# EAGLE design skydrop (EAGLE 7.5.0)
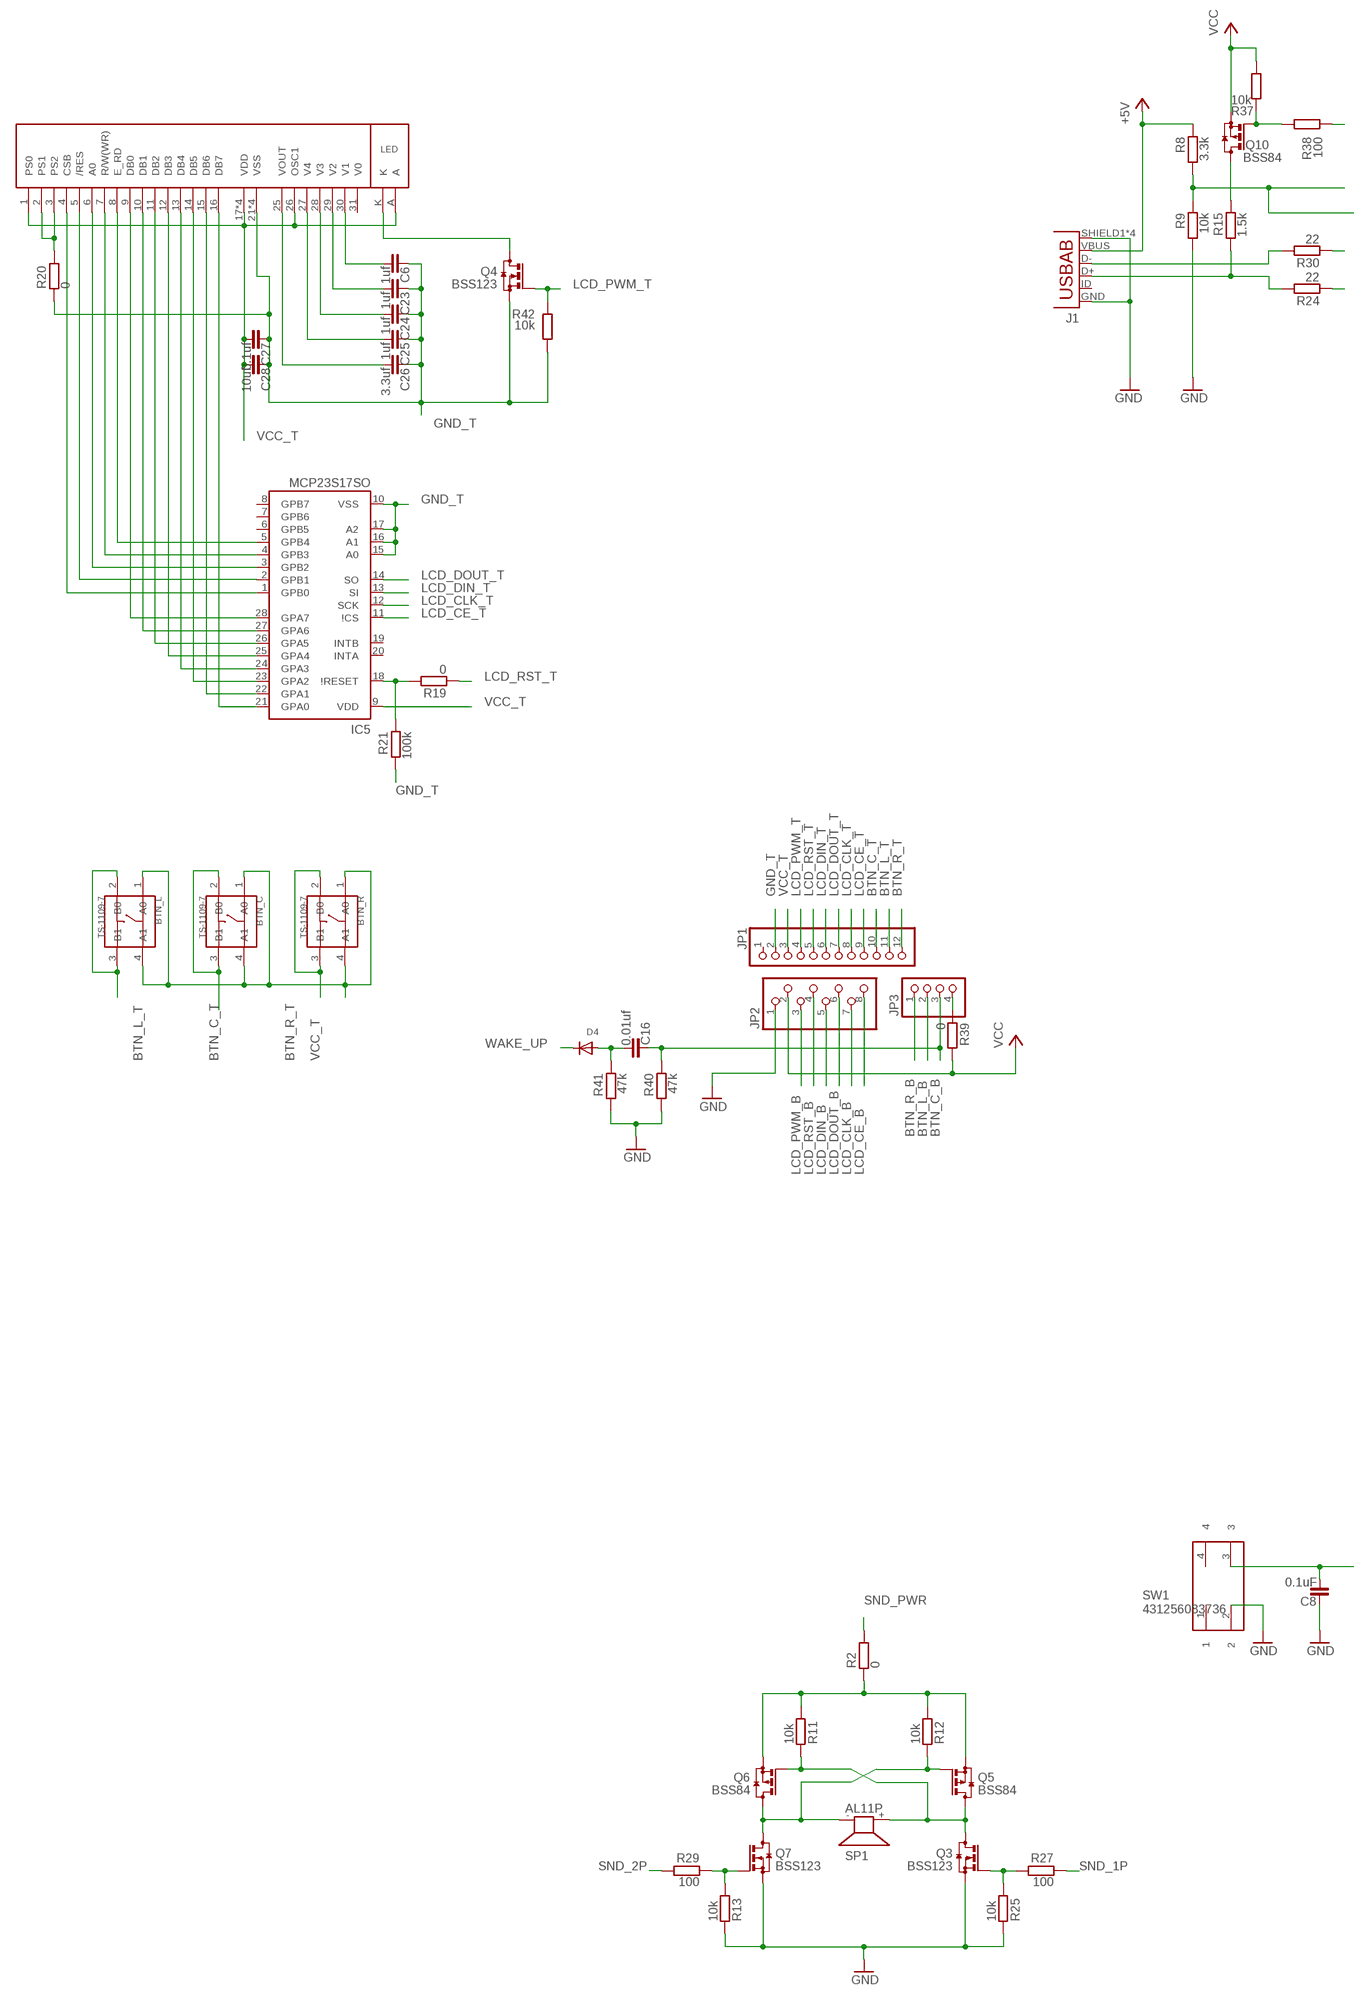
[diagram p0: schematic, sheet 1, part 1 of 2]
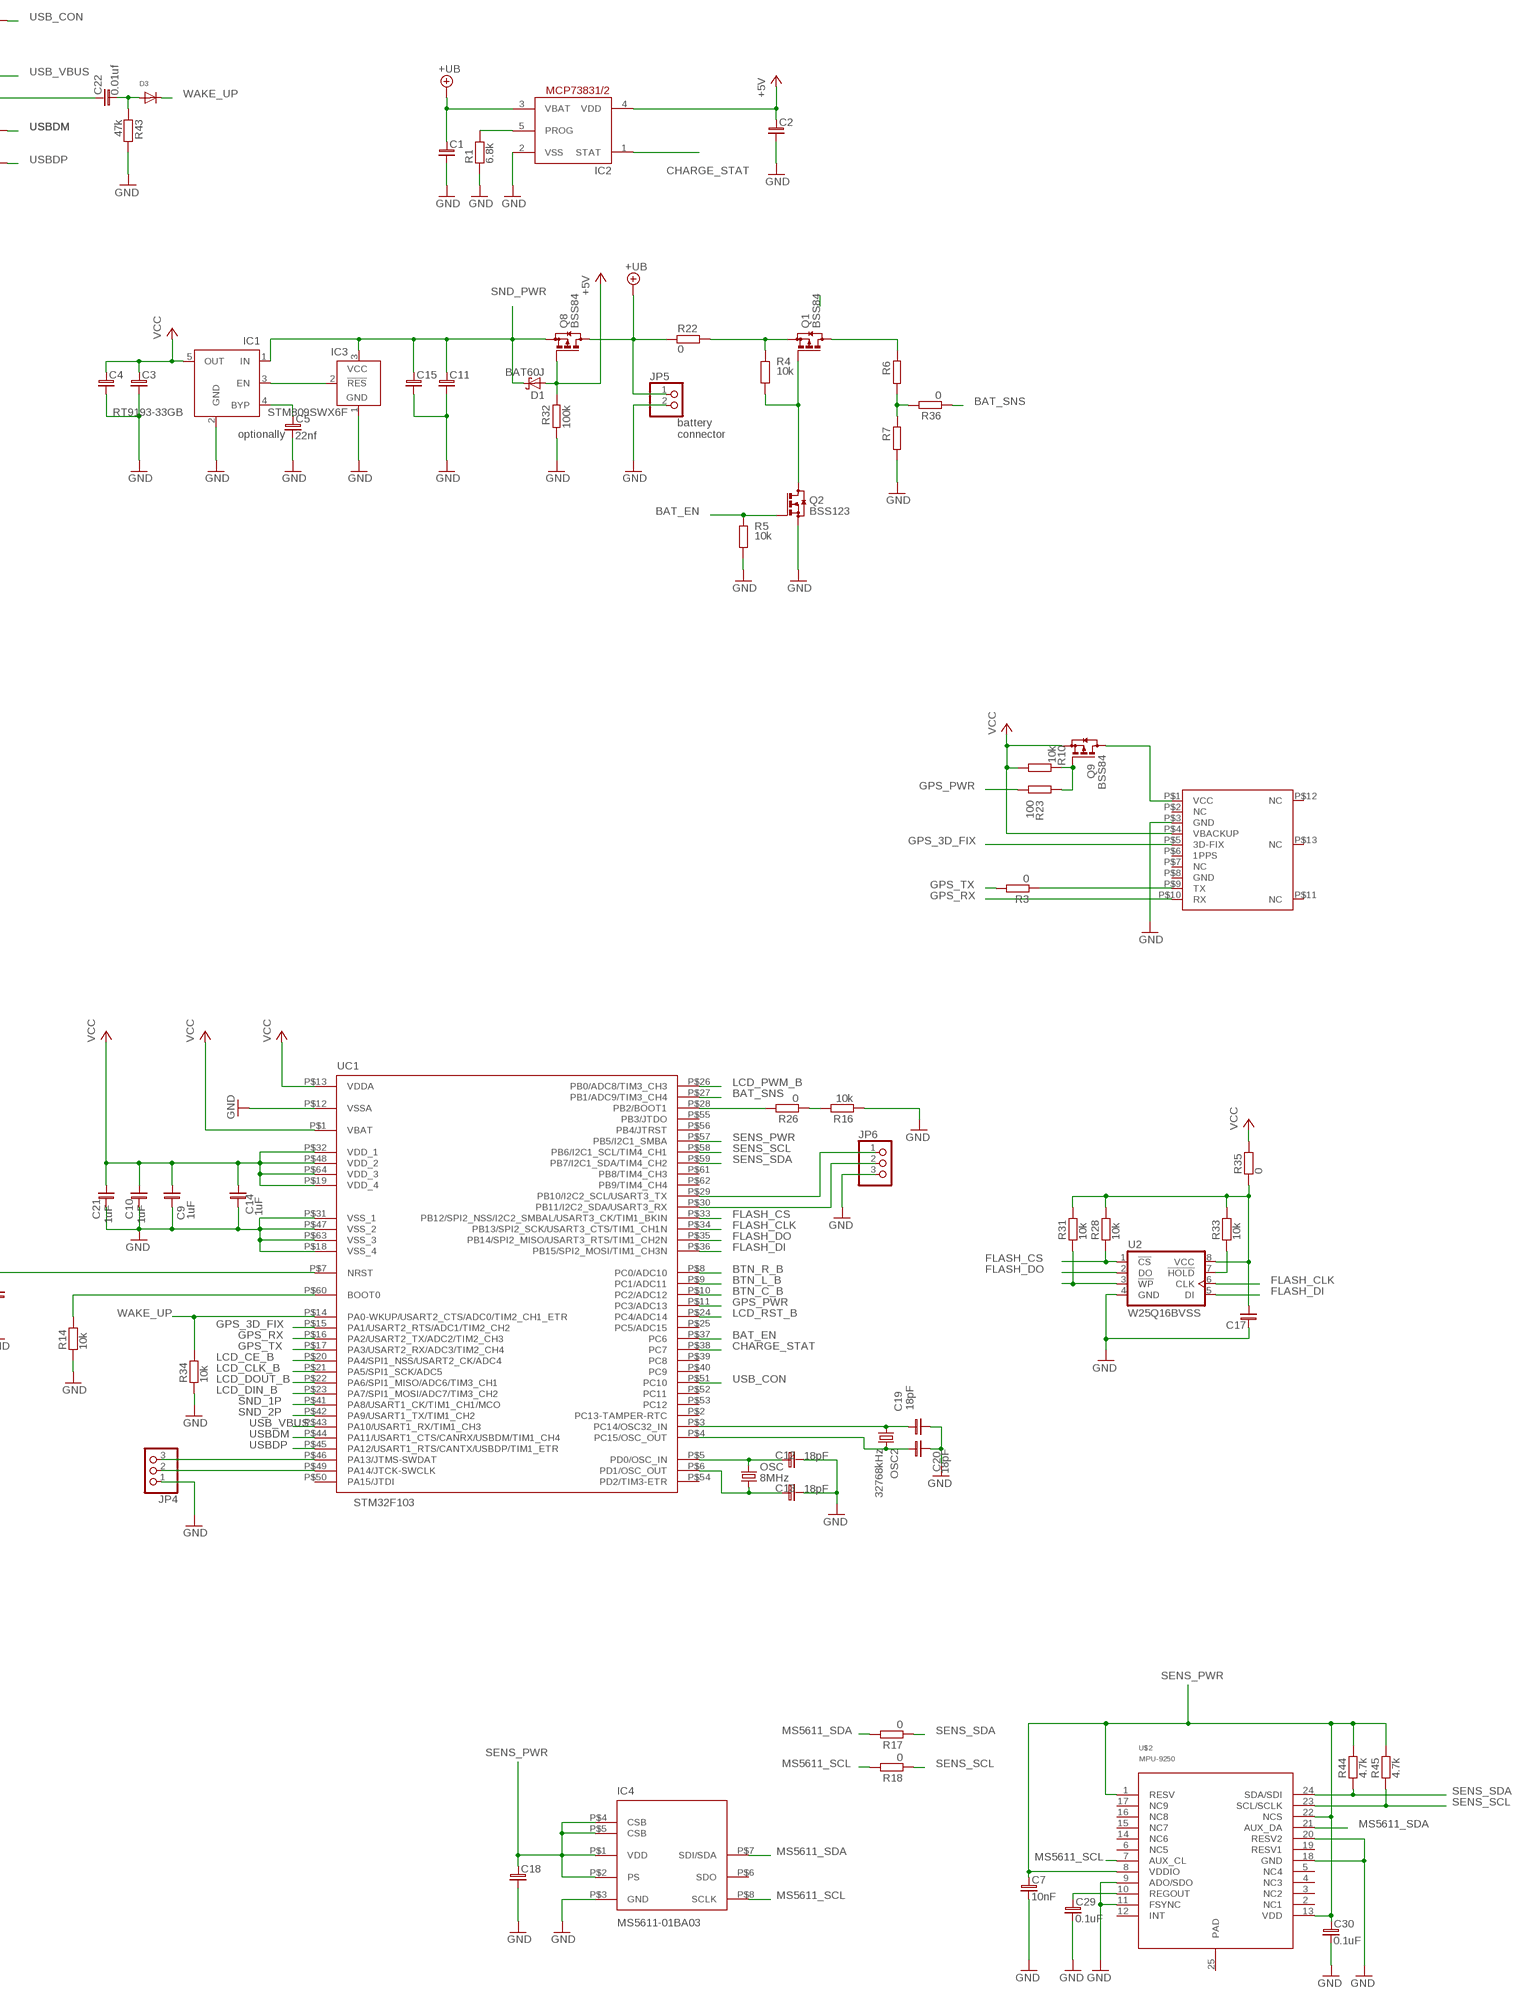
[diagram p1: schematic, sheet 1, part 2 of 2]

## Parts
BTN_C  TS-1109-7  DIP-BUTTON-TOP-BLACK(4P-D6.2MM)  [SW4-6.2X6.2X5.0MM]
BTN_L  TS-1109-7  DIP-BUTTON-TOP-BLACK(4P-D6.2MM)  [SW4-6.2X6.2X5.0MM]
BTN_R  TS-1109-7  DIP-BUTTON-TOP-BLACK(4P-D6.2MM)  [SW4-6.2X6.2X5.0MM]
C1  C_0805  [C0805]
C2  C_0805  [C0805]
C3  C_0805  [C0805]
C4  C_0805  [C0805]
C5  22nf  C_0805  [C0805]
C6  1uf  C_0805  [C0805]
C7  10nF  C_0805  [C0805]
C8  0.1uF  C_0805  [C0805]
C9  1uF  C_0805  [C0805]
C10  1uF  C_0805  [C0805]
C11  C_0805  [C0805]
C12  18pF  C_0805  [C0805]
C13  18pF  C_0805  [C0805]
C14  1uF  C_0805  [C0805]
C15  C_0805  [C0805]
C16  0.01uf  C_0805  [C0805]
C17  C_0805  [C0805]
C18  C_0805  [C0805]
C19  18pF  C_0805  [C0805]
C20  18pF  C_0805  [C0805]
C21  1uF  C_0805  [C0805]
C22  0.01uf  C_0805  [C0805]
C23  1uf  C_0805  [C0805]
C24  1uf  C_0805  [C0805]
C25  1uf  C_0805  [C0805]
C26  3.3uf  C_0805  [C0805]
C27  0.1uf  C_0805  [C0805]
C28  10uf  C_0805  [C0805]
C29  0.1uF  C_0805  [C0805]
C30  0.1uF  C_0805  [C0805]
D1  BAT60J  [SOD323_ST]
D3  DIODE_SOD-123FL  [SOD-123FL]
D4  DIODE_SOD-123FL  [SOD-123FL]
IC1  RT9193-33GB  MIC5219XX  [SOT23-5]
IC2  MCP73831/OT  [SOT23-5L]
IC3  STM809SWX6F  TCM809  [SOT23B-3]
IC4  MS5611-01BA03  [MS5611-01BA03]
IC5  MCP23S17SO  [SO28W]
J1  USB-AB  [USB-AB-MICRO-SMD]
JP1  PINHD-1X12  [1X12]
JP2  PINHD-1X8  [1X08]
JP3  PINHD-1X4  [1X04]
JP4  PINHD-1X3  [1X03]
JP5  PINHD-1X2  [1X02]
JP6  PINHD-1X3  [1X03]
OSC  8MHz  CRYSTALHC49S  [HC49/S]
OSC2  32768kHz  CRYSTALMM20SS  [MM20SS]
Q1  BSS84  [SOT23]
Q2  BSS123  [SOT23]
Q3  BSS123  [SOT23]
Q4  BSS123  [SOT23]
Q5  BSS84  [SOT23]
Q6  BSS84  [SOT23]
Q7  BSS123  [SOT23]
Q8  BSS84  [SOT23]
Q9  BSS84  [SOT23]
Q10  BSS84  [SOT23]
R1  6.8k  R_0805  [R0805]
R2  0  R_1206  [R1206]
R3  0  R_1206  [R1206]
R4  10k  R_0805  [R0805]
R5  10k  R_0805  [R0805]
R6  R_0805  [R0805]
R7  R_0805  [R0805]
R8  3.3k  R_0805  [R0805]
R9  10k  R_0805  [R0805]
R10  10k  R_0805  [R0805]
R11  10k  R_0805  [R0805]
R12  10k  R_0805  [R0805]
R13  10k  R_0805  [R0805]
R14  10k  R_0805  [R0805]
R15  1.5k  R_0805  [R0805]
R16  10k  R_0805  [R0805]
R17  0  R_1206  [R1206]
R18  0  R_1206  [R1206]
R19  0  R_1206  [R1206]
R20  0  R_1206  [R1206]
R21  100k  R_0805  [R0805]
R22  0  R_1206  [R1206]
R23  100  R_0805  [R0805]
R24  22  R_0805  [R0805]
R25  10k  R_0805  [R0805]
R26  0  R_1206  [R1206]
R27  100  R_0805  [R0805]
R28  10k  R_0805  [R0805]
R29  100  R_0805  [R0805]
R30  22  R_0805  [R0805]
R31  10k  R_0805  [R0805]
R32  100k  R_0805  [R0805]
R33  10k  R_0805  [R0805]
R34  10k  R_0805  [R0805]
R35  0  R_1206  [R1206]
R36  0  R_1206  [R1206]
R37  10k  R_0805  [R0805]
R38  100  R_0805  [R0805]
R39  0  R_1206  [R1206]
R40  47k  R_0805  [R0805]
R41  47k  R_0805  [R0805]
R42  10k  R_0805  [R0805]
R43  47k  R_0805  [R0805]
R44  4.7k  R_0805  [R0805]
R45  4.7k  R_0805  [R0805]
SP1  AL11P  [AL11P]
SW1  431256083736  [431256083736]
U1  GPS_FGPMMOPA6C  [FGPMMOPA6C]
U2  W25Q16BVSS  [SO08-SS]
U$1  NOKIA5110  [NOKIA5110]
U$2  MPU-9250  [LEAD-QFN24]
UC1  STM32F103  [TQFP-10X10-64]

## Nets
+5V: C2.1 D1.A IC2.4(VDD) J1.VBUS Q8.1(G) R8.1 R32.1
+UB: C1.1 IC2.3(VBAT) JP5.1 Q8.3(D) R22.1
BAT_EN: Q2.1(G) R5.1 UC1.P$37(PC6)
BAT_SNS: R36.1 UC1.P$27(PB1/ADC9/TIM3_CH4)
BTN_C_B: C16.1 JP3.3 R40.1 UC1.P$10(PC2/ADC12)
BTN_C_T: BTN_C.2(B0) BTN_C.3(B1) JP1.10
BTN_L_B: JP3.2 UC1.P$9(PC1/ADC11)
BTN_L_T: BTN_L.2(B0) BTN_L.3(B1) JP1.11
BTN_R_B: JP3.1 UC1.P$8(PC0/ADC10)
BTN_R_T: BTN_R.2(B0) BTN_R.3(B1) JP1.12
CHARGE_STAT: IC2.1(STAT) UC1.P$38(PC7)
FLASH_CLK: U2.6(CLK) UC1.P$34(PB13/SPI2_SCK/USART3_CTS/TIM1_CH1N)
FLASH_CS: R28.1 U2.1(!CS!) UC1.P$33(PB12/SPI2_NSS/I2C2_SMBAL/USART3_CK/TIM1_BKIN)
FLASH_DI: U2.5(DI) UC1.P$36(PB15/SPI2_MOSI/TIM1_CH3N)
FLASH_DO: U2.2(DO) UC1.P$35(PB14/SPI2_MISO/USART3_RTS/TIM1_CH2N)
GND: C1.2 C2.2 C3.2 C4.2 C5.2 C7.2 C8.1 C9.1 C10.1 C11.2 C12.1 C13.1 C14.1 C15.2 C17.1 C18.2 C19.1 C20.1 C21.1 C29.2 C30.2 IC1.2(GND) IC2.2(VSS) IC3.1(GND) IC4.P$3(GND) J1.GND J1.SHIELD1(SHIELD) J1.SHIELD2(SHIELD) J1.SHIELD3(SHIELD) J1.SHIELD4(SHIELD) JP2.1 JP4.1 JP5.2 JP6.3 Q2.2(S) Q3.2(S) Q7.2(S) R1.1 R5.2 R7.2 R9.2 R13.1 R14.1 R16.1 R25.1 R32.2 R34.1 R40.2 R41.2 R43.2 SW1.2 U1.P$3(GND) U2.4(GND) U$2.9(ADO/SDO) U$2.11(FSYNC) U$2.18(GND) U$2.20(RESV2) UC1.P$12(VSSA) UC1.P$18(VSS_4) UC1.P$31(VSS_1) UC1.P$47(VSS_2) UC1.P$63(VSS_3)
GND_T: C6.1 C23.1 C24.1 C25.1 C26.1 C27.1 C28.1 IC5.10(VSS) IC5.15(A0) IC5.16(A1) IC5.17(A2) JP1.2 Q4.2(S) R20.1 R21.2 R42.2 U$1.21(VSS) U$1.22(VSS) U$1.23(VSS) U$1.24(VSS)
GPS_3D_FIX: U1.P$5(3D-FIX) UC1.P$15(PA1/USART2_RTS/ADC1/TIM2_CH2)
GPS_PWR: R23.2 UC1.P$11(PC3/ADC13)
GPS_RX: U1.P$10(RX) UC1.P$16(PA2/USART2_TX/ADC2/TIM2_CH3)
GPS_TX: R3.2 UC1.P$17(PA3/USART2_RX/ADC3/TIM2_CH4)
LCD_CE_B: JP2.8 UC1.P$20(PA4/SPI1_NSS/USART2_CK/ADC4)
LCD_CE_T: IC5.11(\!CS) JP1.9
LCD_CLK_B: JP2.7 UC1.P$21(PA5/SPI1_SCK/ADC5)
LCD_CLK_T: IC5.12(SCK) JP1.8
LCD_DIN_B: JP2.5 UC1.P$23(PA7/SPI1_MOSI/ADC7/TIM3_CH2)
LCD_DIN_T: IC5.13(SI) JP1.6
LCD_DOUT_B: JP2.6 UC1.P$22(PA6/SPI1_MISO/ADC6/TIM3_CH1)
LCD_DOUT_T: IC5.14(SO) JP1.7
LCD_PWM_B: JP2.3 UC1.P$26(PB0/ADC8/TIM3_CH3)
LCD_PWM_T: JP1.4 Q4.1(G) R42.1
LCD_RST_B: JP2.4 UC1.P$24(PC4/ADC14)
LCD_RST_T: JP1.5 R19.1
MS5611_SCL: IC4.P$8(SCLK) R18.2 U$2.7(AUX_CL)
MS5611_SDA: IC4.P$7(SDI/SDA) R17.2 U$2.21(AUX_DA)
N$1: Q5.2(S) Q6.2(S) R2.1 R11.2 R12.2
N$3: IC2.5(PROG) R1.2
N$5: IC1.3(EN) IC3.2(!RES)
N$6: Q7.1(G) R13.2 R29.1
N$9: C5.1 IC1.4(BYP)
N$11: C8.2 SW1.3 UC1.P$7(NRST)
N$12: Q1.1(G) Q2.3(D) R4.2
N$14: Q1.2(S) R4.1 R22.2
N$15: IC5.18(\!RESET) R19.2 R21.1
N$17: R3.1 U1.P$9(TX)
N$18: Q9.1(G) R10.1 R23.1
N$19: Q3.1(G) R25.2 R27.2
N$20: R14.2 UC1.P$60(BOOT0)
N$21: JP4.3 UC1.P$46(PA13/JTMS-SWDAT)
N$22: JP4.2 UC1.P$49(PA14/JTCK-SWCLK)
N$23: R33.1 U2.7(!HOLD!)
N$25: C19.2 OSC2.1 UC1.P$3(PC14/OSC32_IN)
N$26: Q4.3(D) U$1.K
N$27: J1.D- R30.2
N$28: R31.1 U2.3(!WP!)
N$29: J1.D+ R15.2 R24.2
N$30: Q9.3(D) U1.P$1(VCC)
N$31: R26.2 UC1.P$28(PB2/BOOT1)
N$32: R16.2 R26.1
N$33: JP6.1 UC1.P$29(PB10/I2C2_SCL/USART3_TX)
N$34: JP6.2 UC1.P$30(PB11/I2C2_SDA/USART3_RX)
N$35: Q1.3(D) R6.1
N$36: C20.2 OSC2.4 UC1.P$4(PC15/OSC_OUT)
N$37: C17.2 R28.2 R31.2 R33.2 R35.1 U2.8(VCC)
N$38: R6.2 R7.1 R36.2
N$39: Q10.1(G) R37.1 R38.1
N$40: C6.2 U$1.30(V1)
N$41: Q3.3(D) Q5.3(D) Q6.1(G) R11.1 SP1.+
N$42: Q5.1(G) Q6.3(D) Q7.3(D) R12.1 SP1.-
N$43: Q10.3(D) R15.1
N$44: JP3.4 R39.1
N$45: C16.2 D4.A R41.1
N$46: C22.2 D3.A R43.1
N$47: C23.2 U$1.29(V2)
N$48: C24.2 U$1.28(V3)
N$49: C25.2 U$1.27(V4)
N$50: C26.2 U$1.25(VOUT)
N$51: IC5.28(GPA7) U$1.9(DB0)
N$53: IC5.27(GPA6) U$1.10(DB1)
N$54: IC5.26(GPA5) U$1.11(DB2)
N$55: IC5.25(GPA4) U$1.12(DB3)
N$56: IC5.24(GPA3) U$1.13(DB4)
N$57: IC5.23(GPA2) U$1.14(DB5)
N$58: IC5.22(GPA1) U$1.15(DB6)
N$59: IC5.21(GPA0) U$1.16(DB7)
N$60: IC5.1(GPB0) U$1.4(CSB)
N$61: IC5.2(GPB1) U$1.5(/RES)
N$62: IC5.3(GPB2) U$1.6(A0)
N$63: IC5.4(GPB3) U$1.7(R/W(WR))
N$64: IC5.5(GPB4) U$1.8(E_RD)
N$65: R20.2 U$1.2(PS1) U$1.3(PS2)
N$66: C29.1 U$2.10(REGOUT)
OSC_IN_5: C12.2 OSC.2 UC1.P$5(PD0/OSC_IN)
OSC_OUT_6: C13.2 OSC.1 UC1.P$6(PD1/OSC_OUT)
SENS_PWR: C7.1 C18.1 C30.1 IC4.P$1(VDD) IC4.P$2(PS) IC4.P$4(CSB) IC4.P$5(CSB) R44.2 R45.2 U$2.1(RESV) U$2.8(VDDIO) U$2.13(VDD) U$2.22(NCS) UC1.P$57(PB5/I2C1_SMBA)
SENS_SCL: R18.1 R45.1 U$2.23(SCL/SCLK) UC1.P$58(PB6/I2C1_SCL/TIM4_CH1)
SENS_SDA: R17.1 R44.1 U$2.24(SDA/SDI) UC1.P$59(PB7/I2C1_SDA/TIM4_CH2)
SND_1P: R27.1 UC1.P$41(PA8/USART1_CK/TIM1_CH1/MCO)
SND_2P: R29.2 UC1.P$42(PA9/USART1_TX/TIM1_CH2)
SND_PWR: C11.1 C15.1 D1.C IC1.1(IN) IC3.3(VCC) Q8.2(S) R2.2
USB_CON: R38.2 UC1.P$51(PC10)
USB_VBUS: C22.1 R8.2 R9.1 UC1.P$43(PA10/USART1_RX/TIM1_CH3)
USBDM: R30.1 UC1.P$44(PA11/USART1_CTS/CANRX/USBDM/TIM1_CH4)
USBDP: R24.1 UC1.P$45(PA12/USART1_RTS/CANTX/USBDP/TIM1_ETR)
VCC: C3.1 C4.1 C9.2 C10.2 C14.2 C21.2 IC1.5(OUT) JP2.2 Q9.2(S) Q10.2(S) R10.2 R35.2 R37.2 R39.2 U1.P$4(VBACKUP) UC1.P$1(VBAT) UC1.P$13(VDDA) UC1.P$19(VDD_4) UC1.P$32(VDD_1) UC1.P$48(VDD_2) UC1.P$64(VDD_3)
VCC_T: BTN_C.1(A0) BTN_C.4(A1) BTN_L.1(A0) BTN_L.4(A1) BTN_R.1(A0) BTN_R.4(A1) C27.2 C28.2 IC5.9(VDD) JP1.3 U$1.1(PS0) U$1.17(VDD) U$1.18(VDD) U$1.19(VDD) U$1.20(VDD) U$1.26(OSC1) U$1.A
WAKE_UP: D3.C D4.C R34.2 UC1.P$14(PA0-WKUP/USART2_CTS/ADC0/TIM2_CH1_ETR)
Unconnected: IC4.P$6(SDO) IC5.6(GPB5) IC5.7(GPB6) IC5.8(GPB7) IC5.19(INTB) IC5.20(INTA) J1.ID(USBID) JP1.1 SW1.1 SW1.4 U1.P$2(NC) U1.P$6(1PPS) U1.P$7(NC) U1.P$8(GND) U1.P$11(NC) U1.P$12(NC) U1.P$13(NC) U$1.31(V0) U$2.2(NC1) U$2.3(NC2) U$2.4(NC3) U$2.5(NC4) U$2.6(NC5) U$2.12(INT) U$2.14(NC6) U$2.15(NC7) U$2.16(NC8) U$2.17(NC9) U$2.19(RESV1) U$2.25(PAD) UC1.P$2(PC13-TAMPER-RTC) UC1.P$25(PC5/ADC15) UC1.P$39(PC8) UC1.P$40(PC9) UC1.P$50(PA15/JTDI) UC1.P$52(PC11) UC1.P$53(PC12) UC1.P$54(PD2/TIM3-ETR) UC1.P$55(PB3/JTDO) UC1.P$56(PB4/JTRST) UC1.P$61(PB8/TIM4_CH3) UC1.P$62(PB9/TIM4_CH4)

## Notes on the sheet
- optionally
- battery
  connector

## Library data of the parts
BTN_C BTN_L BTN_R = skydrop:DIP-BUTTON-TOP-BLACK(4P-D6.2MM): 311020032; MPN: TS-1109-7
C1-C30 = skydrop:C_: NON-POLARIZED CAP
D1 = diode:BAT60J: Schottky barrier diode Source: www.st.com, BAT60J.pdf
D3 D4 = skydrop:DIODE: Diode SMADIODE - SMA Surface Mount Package 20V 1A Schottky Diode Digikey: 641-1014-6-ND DO-1N4148 - Through Hole Small Current Diode SOD-123 20V 1 A (.5mV Vf) Schottky Diode - Digikey: MBRX120TPMSCT-ND SOD-323 10V 570mA (.38mV Vf, 3ns) Schottky Diode - Digikey: ZLLS410CT-ND SOD-523 30V 30mA Schottky Diode (RB751S-40TE61) - Digikey: RB751S-40TE61CT-ND SOT23-R/W - SOT23 Package (R = Solder Paste/Reflow Ovens, W = Hand-Soldering) BAT54Film 40V 300mA - Digikey: 497-7162-1-ND
IC1 = skydrop:MIC5219XX: VOLTAGE REGULATOR; OC_FARNELL: unknown; OC_NEWARK: unknown
IC2 = skydrop:MCP73831: MCP73831/2 Miniature Single-Cell, Fully Integrated Li-Ion, Li-Polymer Charge Management Controllers. Nice and small simple lipoly charge controller, with adjustable current and status output (LED) http://www.ladyada.net/library/pcb/eaglelibrary.html
IC3 = skydrop:TCM809: POWER SUPPLY MONITOR replacement for Maxim MAX809 and MAX810; MF: MICROCHIP; MPN: TCM809MENB713; OC_FARNELL: 9762744; OC_NEWARK: 96K3998
IC4 = skydrop:MS5611-01BA03: Variometer Module, with stainless steel cap
IC5 = skydrop:MCP23S17: http://ww1.microchip.com/downloads/en/DeviceDoc/21952a.pdf Source: http://ww1.microchip.com/downloads/en/DeviceDoc/21952a.pdf
J1 = skydrop:USB-AB: This is a USB AB connector that is compatible with USB OTG. i.e. this connector can serve as a host or device
JP1 = pinhead:PINHD-1X12: PIN HEADER
JP2 = skydrop:PINHD-1X8: PIN HEADER
JP3 = pinhead:PINHD-1X4: PIN HEADER
JP4 JP6 = skydrop:PINHD-1X3: PIN HEADER
JP5 = skydrop:PINHD-1X2: PIN HEADER
OSC = skydrop:CRYSTAL: CRYSTAL; OC_FARNELL: 1667008; OC_NEWARK: unknown
OSC2 = skydrop:CRYSTAL: CRYSTAL; OC_FARNELL: unknown; OC_NEWARK: unknown
Q1 Q5 Q6 Q8-Q10 = transistor-small-signal:BSS84: P-CHANNEL MOS FET
Q2-Q4 Q7 = transistor-small-signal:BSS123: N-CHANNEL MOS FET
R1-R45 = skydrop:R_: RESISTOR
SP1 = buzzer:AL11P: SPEAKER Source: Buerklin; OC_FARNELL: unknown; OC_NEWARK: unknown
SW1 = skydrop:431256083736: WS-TST, 6*6mm right angle Tact switch,THT, height 8.35mm, 4 pins, salmon actuator, 360gf
U1 = skydrop:GPS_FGPMMOPA6C: FGPMMOPA6C 16x16 GPS Module NMEA Sentences: GGA, GSA, GSV, RMC, VTG
U2 = skydrop:W25Q16BV: EEPROM 4 Mbit SPI Serial Flash7
U$1 = skydrop:NOKIA5110
U$2 = invensense:MPU-9250
UC1 = st-microelectronics:STM32F103

## Net classes
1 vcc: width 0.3 mm

## Board
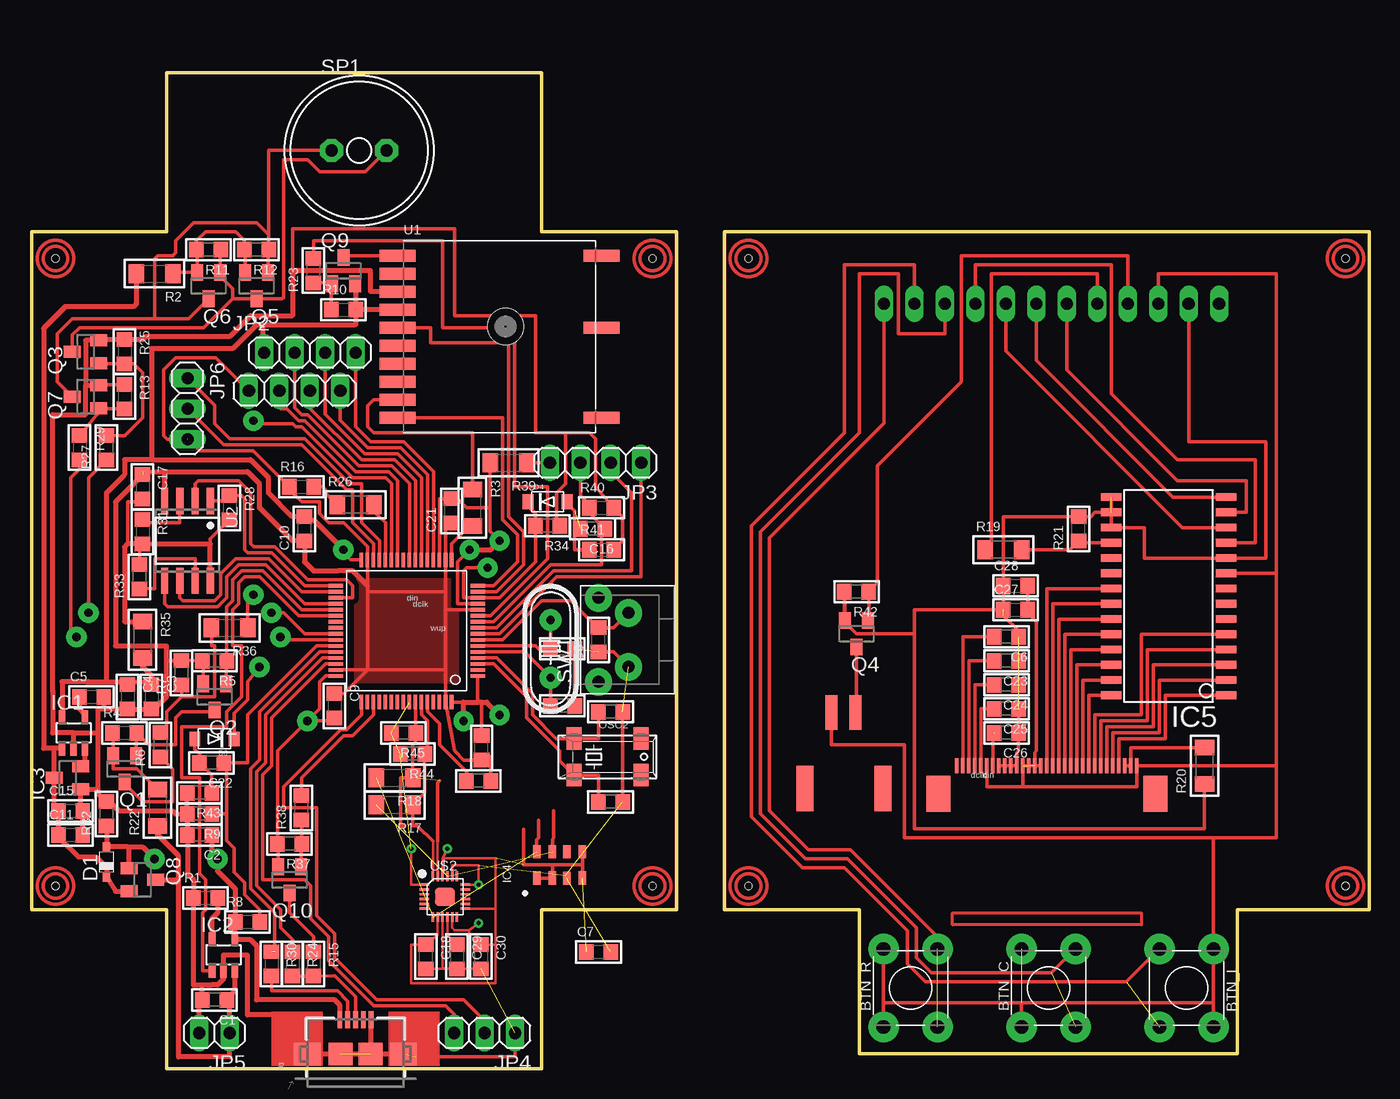
[diagram p2: board, top side]
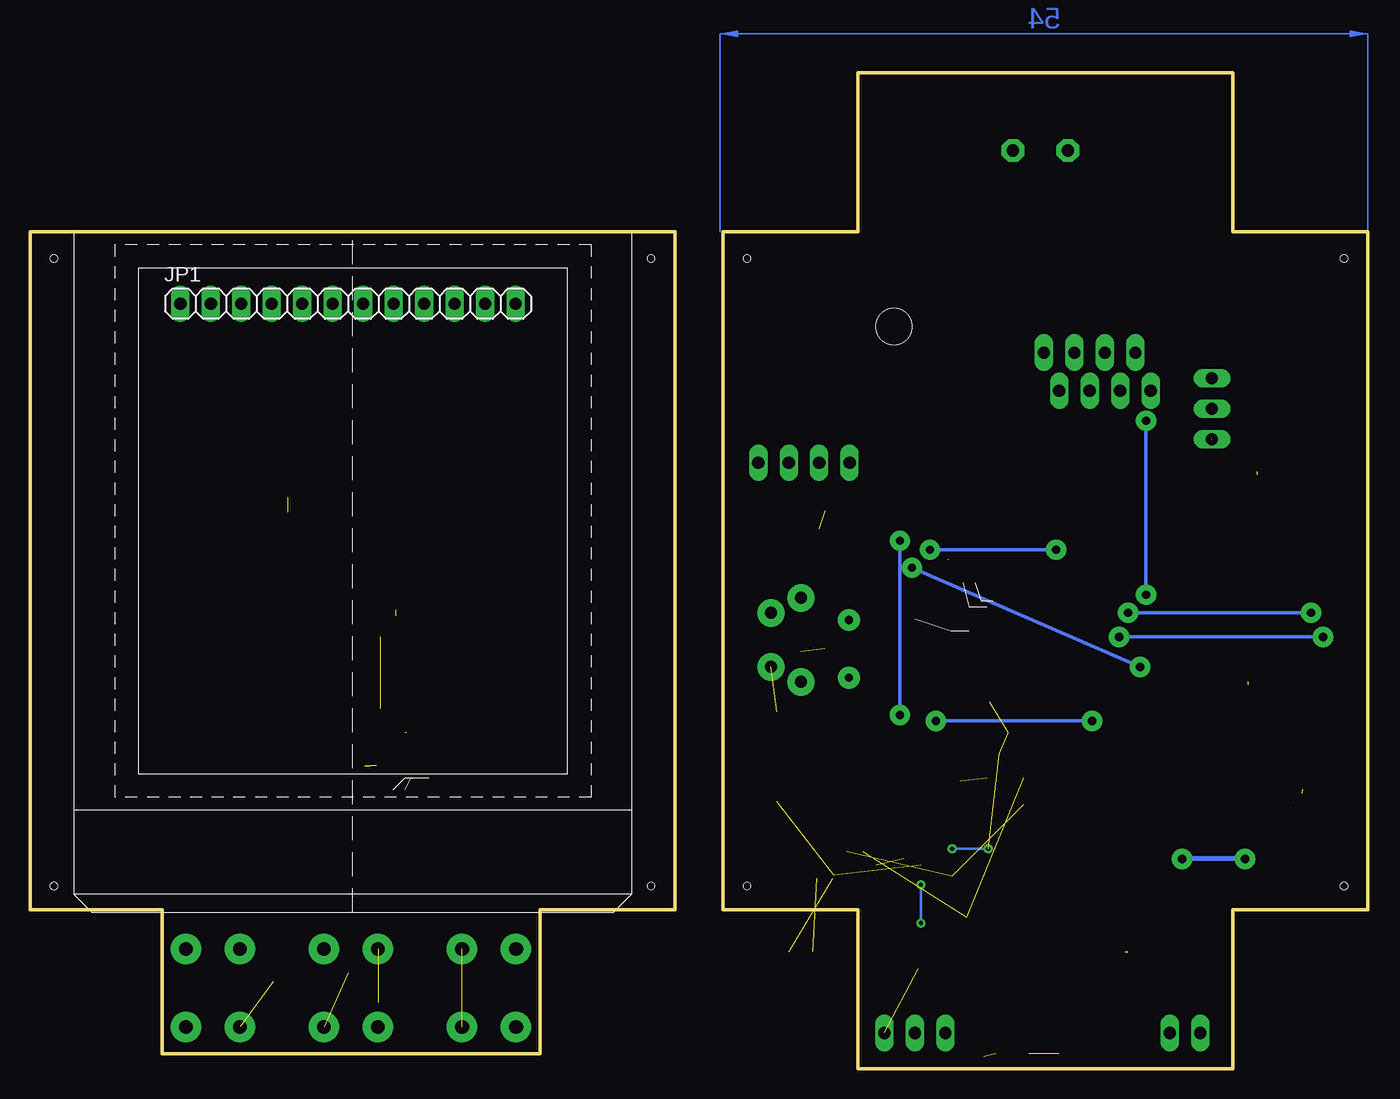
[diagram p3: board, bottom side, seen from below]

Size 111.5 x 83 mm. Coordinates in mm from the lower left corner, seen from the top.
Outline: 0,13.25 11.25,13.25 11.25,0 42.5,0 42.5,13.25 53.75,13.25 53.75,69.75 42.5,69.75 42.5,83 11.25,83 11.25,69.75 0,69.75 0,13.25
Outline: 57.75,69.75 111.5,69.75 111.5,13.25 100.5,13.25 100.5,1.25 69,1.25 69,13.25 57.75,13.25 57.75,69.75
Copper layers (1*16): Top 0.035mm / dielectric 1.5mm / Bottom 0.035mm
Design rules "default *": minimum track width 10mil, minimum drill 24mil, track to track 0.2mm, track to pad 0.2mm, pad to pad 0.2mm, via to via 8mil, smd to smd 0.01mm, copper to edge 0mil, drill to drill 0.7mm, minimum pad ring 10mil, minimum via ring 8mil, stop-mask expansion 4mil, vias tented up to drill 0mil, thermal gap 10mil
Holes 0.6 mm at 59.75,67.5 109.5,67.5 109.5,15.25 59.75,15.25 2,67.5 51.75,67.5 51.75,15.25 2,15.25

### Footprints (pad centres in the part's own frame; a part is rotated, then mirrored left to right if it is on the bottom)
SW4-6.2X6.2X5.0MM = drill 1.143 pad 2.54: 1 -3.25,2.25; 2 -3.25,-2.25; 3 3.25,-2.25; 4 3.25,2.25
C0805 = smd 1.2 x 1.3: 1 -1.016,0; 2 1.016,0
SOD323_ST = smd 0.8 x 0.6: A 1.25,0; C -1.25,0
SOD-123FL = smd 0.91 x 1.22: A 1.637,0; C -1.637,0
SOT23-5 = smd 0.55 x 1.2: 1 -0.95,-1.3; 2 0,-1.3; 3 0.95,-1.3; 4 0.95,1.3; 5 -0.95,1.3
SOT23-5L = smd 0.55 x 1.2: 1 -0.95,-1.3; 2 0,-1.3; 3 0.95,-1.3; 4 0.95,1.3; 5 -0.95,1.3
SOT23B-3 = smd 1 x 1.4: 1 -0.95,-1.1; 2 0.95,-1.1; 3 0,1.1
MS5611-01BA03 = smd 1.1 x 0.6: P$1 -1.1,1.9; P$2 -1.1,0.6; P$3 -1.11,-0.6; P$4 -1.1,-1.9; P$5 1.1,-1.9; P$6 1.1,-0.6; P$7 1.1,0.6; P$8 1.1,1.9
SO28W = smd 0.65 x 1.7: 1 -7.62,-4.78; 2 -6.35,-4.78; 3 -5.08,-4.78; 4 -3.81,-4.78; 5 -2.54,-4.78; 6 -1.27,-4.78; 7 0,-4.78; 8 1.27,-4.78; 9 2.54,-4.78; 10 3.81,-4.78; 11 5.08,-4.78; 12 6.35,-4.78; 13 7.62,-4.78; 14 8.89,-4.78; 15 8.89,4.78; 16 7.62,4.78; 17 6.35,4.78; 18 5.08,4.78; 19 3.81,4.78; 20 2.54,4.78; 21 1.27,4.78; 22 0,4.78; 23 -1.27,4.78; 24 -2.54,4.78; 25 -3.81,4.78; 26 -5.08,4.78; 27 -6.35,4.78; 28 -7.62,4.78
USB-AB-MICRO-SMD = smd 1.4 x 0.4: D+ 2.85,0; D- 2.85,0.65; GND 2.85,-1.3; ID 2.85,-0.65; VBUS 2.85,1.3 | smd 1.9 x 2.2: SHIELD1 0,4; SHIELD4 0,-4 | smd 1.9 x 2: SHIELD2 0,1.25; SHIELD3 0,-1.25
1X12 = drill 1.016 long: 1 -13.97,0; 2 -11.43,0; 3 -8.89,0; 4 -6.35,0; 5 -3.81,0; 6 -1.27,0; 7 1.27,0; 8 3.81,0; 9 6.35,0; 10 8.89,0; 11 11.43,0; 12 13.97,0
1X08 = drill 1.016 long: 1 -8.89,0; 2 -7.62,3.175; 3 -6.35,0; 4 -5.08,3.175; 5 -3.81,0; 6 -2.54,3.175; 7 -1.27,0; 8 0,3.175
1X04 = drill 1.016 long: 1 -3.81,0; 2 -1.27,0; 3 1.27,0; 4 3.81,0
1X03 = drill 1.016 long: 1 -2.54,0; 2 0,0; 3 2.54,0
1X02 = drill 1.016 long: 1 -1.27,0; 2 1.27,0
HC49/S = drill 0.7 pad 1.8: 1 -2.413,0; 2 2.413,0
MM20SS = smd 1.27 x 1.88: 1 -2.794,-1.524; 2 2.794,-1.524; 3 2.794,1.524; 4 -2.794,1.524
SOT23 = smd 1 x 1.4: 1 -0.95,-1.1; 2 0.95,-1.1; 3 0,1.1
R0805 = smd 1.2 x 1.3: 1 -1.016,0; 2 1.016,0
R1206 = smd 1.3 x 1.6: 1 -1.524,0; 2 1.524,0
AL11P = drill 1.016 pad 1.905 octagon: + 2.286,0; - -2.286,0
431256083736 = drill 1 pad 2.286: 1 -3.5,1.25; 2 -2.25,-1.25; 3 2.25,-1.25; 4 3.5,1.25
FGPMMOPA6C = smd 3 x 1: P$1 -8.5,6.75; P$2 -8.5,5.25; P$3 -8.5,3.75; P$4 -8.5,2.25; P$5 -8.5,0.75; P$6 -8.5,-0.75; P$7 -8.5,-2.25; P$8 -8.5,-3.75; P$9 -8.5,-5.25; P$10 -8.5,-6.75; P$11 8.5,-6.75; P$12 8.5,0.75; P$13 8.5,6.75 | hole 3: 0.5,0.85
SO08-SS = smd 0.6 x 2.2: 1 -1.905,-3.33; 2 -0.635,-3.33; 3 0.635,-3.33; 4 1.905,-3.33; 5 1.905,3.33; 6 0.635,3.33; 7 -0.635,3.33; 8 -1.905,3.33
NOKIA5110 = smd 0.3 x 1.25 bottom: 1 16.65,13; 2 17.15,13; 3 17.65,13; 4 18.15,13; 5 18.65,13; 6 19.15,13; 7 19.65,13; 8 20.15,13; 9 20.65,13; 10 21.15,13; 11 21.65,13; 12 22.15,13; 13 22.65,13; 14 23.15,13; 15 23.65,13; 16 24.15,13; 17 24.65,13; 18 25.15,13; 19 25.65,13; 20 26.15,13; 21 26.65,13; 22 27.15,13; 23 27.65,13; 24 28.15,13; 25 28.65,13; 26 29.15,13; 27 29.65,13; 28 30.15,13; 29 30.65,13; 30 31.15,13; 31 31.65,13 | smd 1 x 2.85 bottom: A 42.1,17.45; K 40.1,17.45 | smd 2 x 3 bottom: P$1 33.19,10.68; P$2 15.11,10.68 | smd 1.4 x 3.8 bottom: P$5 44.3,11.1; P$6 37.8,11.1
LEAD-QFN24 = smd 0.8 x 0.2: 1 -1.7,1; 2 -1.7,0.6; 3 -1.7,0.2; 4 -1.7,-0.2; 5 -1.7,-0.6; 6 -1.7,-1; 13 1.7,-1; 14 1.7,-0.6; 15 1.7,-0.2; 16 1.7,0.2; 17 1.7,0.6; 18 1.7,1 | smd 0.2 x 0.8: 7 -1,-1.7; 8 -0.6,-1.7; 9 -0.2,-1.7; 10 0.2,-1.7; 11 0.6,-1.7; 12 1,-1.7; 19 1,1.7; 20 0.6,1.7; 21 0.2,1.7; 22 -0.2,1.7; 23 -0.6,1.7; 24 -1,1.7 | smd 1.7 x 1.54: 25 0,0
TQFP-10X10-64 = smd 1.2 x 0.3: P$1 -5.936,3.75; P$2 -5.936,3.25; P$3 -5.936,2.75; P$4 -5.936,2.25; P$5 -5.936,1.75; P$6 -5.936,1.25; P$7 -5.936,0.75; P$8 -5.936,0.25; P$9 -5.936,-0.25; P$10 -5.936,-0.75; P$11 -5.936,-1.25; P$12 -5.936,-1.75; P$13 -5.936,-2.25; P$14 -5.936,-2.75; P$15 -5.936,-3.25; P$16 -5.936,-3.75; P$33 5.886,-3.75; P$34 5.886,-3.25; P$35 5.886,-2.75; P$36 5.886,-2.25; P$37 5.886,-1.75; P$38 5.886,-1.25; P$39 5.886,-0.75; P$40 5.886,-0.25; P$41 5.886,0.25; P$42 5.886,0.75; P$43 5.886,1.25; P$44 5.886,1.75; P$45 5.886,2.25; P$46 5.886,2.75; P$47 5.886,3.25; P$48 5.886,3.75 | smd 0.3 x 1.2: P$17 -3.75,-5.911; P$18 -3.25,-5.911; P$19 -2.75,-5.911; P$20 -2.25,-5.911; P$21 -1.75,-5.911; P$22 -1.25,-5.911; P$23 -0.75,-5.911; P$24 -0.25,-5.911; P$25 0.25,-5.911; P$26 0.75,-5.911; P$27 1.25,-5.911; P$28 1.75,-5.911; P$29 2.25,-5.911; P$30 2.75,-5.911; P$31 3.25,-5.911; P$32 3.75,-5.911; P$49 3.75,5.936; P$50 3.25,5.936; P$51 2.75,5.936; P$52 2.25,5.936; P$53 1.75,5.936; P$54 1.25,5.936; P$55 0.75,5.936; P$56 0.25,5.936; P$57 -0.25,5.936; P$58 -0.75,5.936; P$59 -1.25,5.936; P$60 -1.75,5.936; P$61 -2.25,5.936; P$62 -2.75,5.936; P$63 -3.25,5.936; P$64 -3.75,5.936

### Placement (x,y rotation side)
BTN_C  84.75,6.75 90 top
BTN_L  96.25,6.75 270 top
BTN_R  73.25,6.75 90 top
C1  15.25,5.75 180 top
C2  14,19.5 180 top
C3  10,31 270 top
C4  8,31 270 top
C5  5,31 0 top
C6  81.25,36 180 top
C7  47.25,9.75 0 top
C8  47.25,35.75 90 top
C9  25.25,30.25 270 top
C10  22.75,45 90 top
C11  3.25,19.5 0 top
C12  44.25,30.25 180 top
C13  44.25,35 180 top
C14  37.5,26.75 90 top
C15  3.25,21.5 0 top
C16  46.75,45 180 top
C17  9.25,48.5 270 top
C18  32.85,9.35 270 top
C19  48.25,22.25 180 top
C20  48.25,29.75 180 top
C21  35,46.5 90 top
C22  15,25.5 180 top
C23  81.25,34 180 top
C24  81.25,32 180 top
C25  81.25,30 180 top
C26  81.25,28 180 top
C27  82,38.25 0 top
C28  82,40.25 0 top
C29  35.45,9.35 270 top
C30  37.45,9.35 270 top
D1  6.25,17.25 90 top
D3  15.25,27.5 180 top
D4  43,47.25 0 top
IC1  3.5,28 0 top
IC2  16,9.5 0 top
IC3  3,24.25 90 top
IC4  44,17 90 top
IC5  94.75,38.75 90 top
J1  27,1.25 90 top
JP1  85,63.75 0 bottom
JP2  27,56.5 0 top
JP3  47,50.5 180 top
JP4  37.75,3 180 top
JP5  15.25,3 180 top
JP6  13,55 270 top
OSC  43.25,35 270 top
OSC2  48,26 0 top
Q1  7.75,25 180 top
Q2  15.25,31 180 top
Q3  4.5,59.75 90 top
Q4  68.75,36.25 180 top
Q5  18.75,65.25 180 top
Q6  14.75,65.25 180 top
Q7  4.5,56 90 top
Q8  9.25,15.75 270 top
Q9  26,66.5 0 top
Q10  21.5,15.75 180 top
R1  14.5,14.25 0 top
R2  10.25,66.25 180 top
R3  36.75,46.75 270 top
R4  7.75,28 0 top
R5  15.25,34 180 top
R6  10.75,27 90 top
R7  12.5,33 90 top
R8  18,12.25 0 top
R9  14,21.25 180 top
R10  26,63.25 0 top
R11  14.75,68.25 180 top
R12  18.75,68.25 180 top
R13  7.75,56 270 top
R14  37.25,24 180 top
R15  23.5,8.75 270 top
R16  22.5,48.5 0 top
R17  30.25,22 180 top
R18  30.25,24.25 180 top
R19  81,43.25 0 top
R20  97.75,25.25 90 top
R21  87.25,45 90 top
R22  10.5,21.75 90 top
R23  23.5,66.5 90 top
R24  21.75,8.75 270 top
R25  7.75,59.75 270 top
R26  27,47 0 top
R27  6.25,51.75 90 top
R28  16.5,46.75 270 top
R29  4,51.75 270 top
R30  20,8.75 270 top
R31  9.25,44.75 270 top
R32  6.25,21.25 90 top
R33  9,41 90 top
R34  43,45.25 180 top
R35  9.25,35.75 270 top
R36  16.5,36.75 180 top
R37  21.5,18.75 180 top
R38  22.5,21.75 90 top
R39  39.75,50.5 180 top
R40  47.5,46.75 0 top
R41  47.5,43.25 0 top
R42  68.75,39.75 180 top
R43  14,23 180 top
R44  31.75,26.25 180 top
R45  31,28 180 top
SP1  27.29,76.52 0 top
SW1  48.5,35.75 90 top
U1  39,61 0 top
U2  13,44 180 top
U$1  108.75,12.25 0 bottom
U$2  34.45,14.35 0 top
UC1  31.25,36.5 180 top

### Tracks (layer width: path | path; a pad name or v marks a point on that pad's centre or on a via)
+5V  (via drill 0.7 pad 1.7)
  Top 0.4: 17.25,10.8 IC2.4 | J1.VBUS 25.7,5.3 25.25,5.75 18.75,5.75 18.75,10.25 18.2,10.8 IC2.4 | IC2.4 16.95,12.03 R8.1 16.98,15 15.5,16.48 v15.5,17.5 15.02,17.98 C2.1 | R32.1 D1.A 8,18.5 | 8,18.5 9.25,18.5 v10.25,17.5 | Q8.1 8.15,18.4 8,18.5
  Bottom 0.4: v10.25,17.5 v15.5,17.5
+UB
  Top 0.4: JP5.1 16.52,1 12.25,1 12.25,15.75 | IC2.3 16.95,6.5 C1.1 16.52,5.5 JP5.1 | 16.5,4.25 16.5,3.52 JP5.1 | Q8.3 12.25,15.75 | 12.25,15.75 12.25,17.75 10.5,19.5 R22.1
BAT_EN
  Top 0.3: Q2.1 16.2,33.43 R5.1 | R5.1 16.25,34.02 16.25,34.5 | R5.1 16.27,35 16.25,35.75 16.25,38.5 16.75,39 16.75,40.75 17.5,41.5 19.25,41.5 22.5,38.25 UC1.P$37
BAT_SNS  (via drill 0.7 pad 1.7)
  Top 0.3: UC1.P$27 30,48.75 29.5,49.25 26.75,49.25 22.5,53.5 22,53.5 21.75,53.75 18.5,53.75 v18.5,54 | R36.1 18.02,39.02 v18.5,39.5
  Bottom 0.3: v18.5,54 v18.5,39.5
BTN_C_B
  Top 0.3: UC1.P$10 38.5,37.25 43.25,42 47.5,42 47.5,44.5 47.77,44.52 C16.1 46.48,46.28 R40.1 46.48,47.02 45.75,47.75 45.75,49.25 45.73,49.27 JP3.3
BTN_C_T  (1 unrouted)
  Top 0.3: BTN_C.3 85,8 75,8 73.75,9.25 73.75,11.75 68,17.5 64.5,17.5 60.75,21.25 60.75,44.75 69,53 69,66.25 72.25,66.25 72.25,61.25 76.11,61.25 JP1.10
BTN_L_B
  Top 0.3: UC1.P$9 38.75,36.75 43.5,41.5 50,41.5 50,48 48.27,49.73 JP3.2 48.27,50.48
BTN_L_T  (1 unrouted)
  Top 0.3: BTN_L.2 91.25,7.25 74.5,7.25 73,8.75 73,11.5 67.75,16.75 64.25,16.75 60,21 60,45.25 67.75,53 67.75,67 73.57,67 JP1.11
BTN_R_B
  Top 0.3: UC1.P$8 39,36.25 43.75,41 50.81,41 JP3.1
BTN_R_T  (1 unrouted)
  Top 0.3: BTN_R.3 75.5,11 68.25,18.25 64.75,18.25 61.5,21.5 61.5,44.25 71.03,53.78 JP1.12
CHARGE_STAT
  Top 0.3: IC2.1 14.25,8.2 14.25,13 14.5,13.25 14.5,15.75 14,16.25 14,24.25 12.5,24.25 12.5,28.5 16.25,28.5 16.25,29.75 17.5,31 17.5,35.25 16.75,35.25 16.75,38.25 17.25,38.75 17.25,40.5 17.75,41 19,41 22.25,37.75 UC1.P$38
FLASH_CLK
  Top 0.3: 12.5,40.67 U2.6 12.37,39.25 12.62,39 15.25,39 15.75,39.5 15.75,41.25 17,42.5 19.75,42.5 22.5,39.75 UC1.P$34
FLASH_CS
  Top 0.3: U2.1 16.44,47.33 R28.1 17.5,47.77 17.75,47.52 17.75,43.25 18,43 20,43 22.75,40.25 UC1.P$33
FLASH_DI
  Top 0.3: U2.5 11.1,38.75 11.35,38.5 15.5,38.5 16.25,39.25 16.25,41 17.25,42 19.5,42 22.75,38.75 UC1.P$36
FLASH_DO
  Top 0.3: UC1.P$35 26.75,39.25 26.75,40.25 26.25,40.75 23,40.75 20.25,43.5 18.5,43.5 18.25,43.75 18.25,48 17.25,49 13.89,49 13.64,48.75 U2.2 13.75,47.33
GND  (via drill 0.35)  (12 unrouted)
  Top 0.2: U$2.18 v37.25,15.35 37.25,16.95 35.05,16.95 U$2.20 | U$2.9 34.25,8.35 35.43,8.35 | 35.43,8.35 C29.2 36.45,8.33 | C18.2 35.42,8.33 35.43,8.35 | 36.45,8.33 C30.2 | U$2.11 35.05,11.75 35.25,11.55 36.45,11.55 | 36.45,11.55 36.45,8.33 | 36.45,11.55 v37.25,12.15
  Top 0.3: IC4.P$3 44.5,16.16 44.5,16 44.52,15.98 | UC1.P$47 28,33.25 | 28,33.25 28,39.75 | 28,39.75 28,40.25 UC1.P$31 28,43.5 26,45.5 24.75,45.5 24,46.25 24,47.25 22.5,47.25 21.48,48.27 R16.1 | 34.5,39.75 UC1.P$18 34.5,45.48 C21.1 | 34.5,39.75 28,39.75 | 34.5,38.25 UC1.P$12 | 34.5,38.25 34.5,39.75 | 34.5,33.25 UC1.P$63 35.25,26.5 36.02,25.73 C14.1 38.27,26 R14.1 | 34.5,33.25 28,33.25 | 34.5,38.25 34.5,33.25 | R13.1 5.6,57.02 Q7.2 | 5.6,60.75 Q3.2 5.6,60.77 | J1.SHIELD3 28.3,1.25 | Q2.2 14.3,33.43 R5.2 14.22,34.02 R7.2 11.25,34.02 | 28.3,3.98 J1.GND | 28,33.25 26,31.25 25.27,31.25 C9.1 | JP6.3 11.29,52.46 11,52.75 11,58.25 12,59.25 15.36,59.25 JP2.1 | 21.75,66.5 21.75,70 35.25,70 35.25,62.75 42,62.75 42,53 44.5,53 | 13,52.5 14,51.5 18.48,51.5 R16.1 | 44.5,53 46.5,53 47,52.5 47,48.52 R40.2 49.25,46.02 49.25,44 48.52,43.27 R41.2 | C19.1 C20.1 | C8.1 48.52,34.73 SW1.2 | 21.73,48.25 R16.1 | JP4.1 40.29,1 32,1 | 44.5,53 44.5,48.75 43.77,48.02 43.77,45.5 R34.1 | C13.1 C12.1
  Top 0.4: IC1.2 3.5,28 | Q3.2 4.5,60.7 4.5,56.95 | 4.5,56.95 Q7.2 | 5.6,60.77 R25.1 9.27,60.77 9.5,61 16.5,61 18.25,62.75 21.75,62.75 21.75,66.5 28.25,66.5 28.25,64.75 U1.P$3 | 5.52,28 5.52,29.98 6,29.98 | 3.5,28 5.52,28 | J1.SHIELD4 J1.SHIELD3 J1.SHIELD1 23,4.5 18,4.5 18,9.5 16,9.5 IC2.2 16,7.5 15.5,7 15,7 | 28.3,1.25 J1.GND | 5.47,23.3 IC3.1 4.1,21.5 C15.2 | C15.2 4.27,19.25 C11.2 | 4.27,21 C15.2 | 9.25,49.75 11.1,49.75 | 28,40.25 26.77,41.48 25.52,41.48 25.5,41.5 23.5,41.5 22.75,42.25 C10.1 21.77,43.98 19,46.75 19,48.75 18,49.75 11.1,49.75 | U2.4 11.1,49.75 | 6,29.98 C4.2 C3.2 10.23,29.98 11.25,31 11.25,34.02 11.25,35.25 7,35.25 7,47.25 9.25,49.5 C17.1 | 4.5,54.5 4.5,56.95 | 14.25,7 13.5,7 13.5,14.02 R1.1 13.5,14.27 13.5,15.75 13,16.25 13,20.48 C2.2 R9.2 | 14.25,7 15,7 | 3.5,28 1.75,28 1.75,31.5 | C5.2 6.02,29.98 6,29.98 | R9.2 R43.2 | 14.98,6.98 15,7 | JP5.2 13.98,5.5 C1.2 14.23,6.98 14.25,7 | 5.52,28 5.52,22.98 6.25,22.25 6.5,22.25 7.25,21.5 11.75,21.5 12,21.25 R9.2 | 12.5,33.98 12.47,33.98 R7.2 12.5,33.98
  Top 0.406: 1.75,31.5 1.75,54.5 4.5,54.5
  Bottom 0.2: v37.25,12.15 v37.25,15.35
  pour Top (isolate 0.4): 27,32.25 35.5,32.25 35.5,40.75 27,40.75
GND_T  (5 unrouted)
  Top 0.3: U$1.24 U$1.23 U$1.22 U$1.21 82.1,26.35 82.25,26.5 82.25,27.98 C26.1 | IC5.15 IC5.17 92.75,45.1 92.75,42.56 IC5.10 102.88,42.56 102.88,52.25 96.43,52.25 JP1.2 | IC5.16 88.62,46.37 88.27,46.02 R21.2 87.22,45.98 80.98,45.98 C28.1 C27.1 73.57,38.25 73.57,36.25 | 82.1,27.83 C26.1 | C26.1 C25.1 | C6.1 82.27,36.48 81,37.75 | R20.1 97.75,20 73.57,20 73.57,36.25 | Q4.2 67.8,39.68 R42.2 67.73,37.27 68.75,36.25 73.57,36.25
GPS_3D_FIX
  Top 0.3: U1.P$5 33.25,61.75 33.25,60.5 39.75,60.5 39.75,46 41,44.75 41,42 38.75,39.75 UC1.P$15
GPS_PWR
  Top 0.3: R23.2 23.5,69 34.25,69 34.25,61.75 40.25,61.75 40.25,48.5 43,48.5 43,42.5 38.25,37.75 UC1.P$11
GPS_RX
  Top 0.3: UC1.P$16 38.5,40.25 40.5,42.25 40.5,44.5 39.25,45.75 39.25,54.25 U1.P$10
GPS_TX  (1 unrouted)
  Top 0.3: R3.2 36.49,45.23 35.8,44.53 35.78,44.53 35,43.75 35,42.46
LCD_CE_B
  Top 0.3: UC1.P$20 33.5,49.75 31,52.25 28.25,52.25 28,52.49 27,53.5 JP2.8
LCD_CE_T
  Top 0.3: JP1.9 78.65,67 90,67 90,56.25 95.5,50.75 102,50.75 102,43.83 IC5.11
LCD_CLK_B
  Top 0.3: UC1.P$21 33,49.5 30.75,51.75 28,51.75 25.73,54.02 JP2.7 25.73,55.52
LCD_CLK_T
  Top 0.3: IC5.12 95.9,45.1 81.19,59.81 JP1.8
LCD_DIN_B
  Top 0.3: UC1.P$23 32,49 30.25,50.75 27.5,50.75 23.19,55.06 JP2.5
LCD_DIN_T
  Top 0.3: JP1.6 86.27,58.23 95.5,49 101.25,49 101.25,46.37 IC5.13
LCD_DOUT_B
  Top 0.3: UC1.P$22 32.5,49.25 30.5,51.25 27.75,51.25 24.46,54.54 JP2.6
LCD_DOUT_T
  Top 0.3: IC5.14 95.11,47.64 83.73,59.02 JP1.7
LCD_PWM_B
  Top 0.3: UC1.P$26 30.5,49 29.75,49.75 27,49.75 22.75,54 22.25,54 21.25,55 20.75,55 20.65,55.1 JP2.3
LCD_PWM_T
  Top 0.3: Q4.1 69.77,37.42 R42.1 70.5,40.48 70.5,50.25 77.5,57.25 77.5,67.75 91.35,67.75 JP1.4
LCD_RST_B
  Top 0.3: UC1.P$24 31.5,48.75 30,50.25 27.25,50.25 23,54.5 22.5,54.5 21.92,55.08 JP2.4
LCD_RST_T
  Top 0.3: R19.1 80,43.77 80,66.25 88.81,66.25 JP1.5
MS5611_SCL  (2 unrouted)
  Top 0.3: IC4.P$8 42.1,19.1 42.25,19.25 42.25,20.73
MS5611_SDA  (2 unrouted)
  Top 0.3: 43.5,18.2 IC4.P$7 43.4,19.1 43.5,19.25 43.5,21.5
N$1
  Top 0.3: 13.73,66.35 Q6.2 | 17.73,66.35 Q5.2 17.8,68.25 R12.2 17.73,69.02 17,69.75 14.5,69.75 13.73,68.98 R11.2 | 13.75,68.25 R11.2 | Q6.2 13.8,68.25 R11.2 | R2.1 11.87,66.35 Q6.2
N$3
  Top 0.4: R1.2 15.52,13.02 15.05,12.55 IC2.5
N$5
  Top 0.4: IC1.3 4.45,25.2 IC3.2
N$6
  Top 0.3: R13.2 5.6,54.98 Q7.1 5.75,54.9 R29.1
N$9
  Top 0.4: IC1.4 4.45,29.55 4,30 4,30.98 C5.1
N$11
  Top 0.3: SW1.3 48.52,36.77 C8.2 46.1,37.86 44.96,39 42.5,39 39.25,35.75 UC1.P$7
N$12
  Top 0.3: Q1.1 8.7,27.5 R4.2 9.25,27.5 9.75,27 12,27 12,29.25 12.5,29.75 15.1,29.75 Q2.3
N$14
  Top 0.3: R4.1 6.8,27.5 Q1.2 6.8,25 8.75,25 9,24.77 R22.2
N$15
  Top 0.3: IC5.18 87.4,43.83 R21.1 86.52,43.25 R19.2
N$17
  Top 0.3: U1.P$9 28.5,55.75 28,55.25 28,53.5 28.5,53 36.75,53 R3.1
N$18
  Top 0.3: R10.1 24.98,65.4 Q9.1 24.97,65.48 R23.1
N$19
  Top 0.3: Q3.1 5.6,58.73 R25.2 7.77,58.75 8.5,58.75 9.25,58 9.25,54.25 7.75,52.75 6.52,52.77 R27.2
N$20
  Top 0.3: UC1.P$60 33,29.75 34,28.75 34,27 36.23,24.77 R14.2
N$21
  Top 0.3: JP4.3 35.21,4.54 34.5,5.25 28.5,5.25 24.75,9 24.75,11 23.25,12.5 23.25,15.25 22.75,15.75 19.25,15.75 19.25,24.5 20,25.25 20,29.25 24.5,33.75 UC1.P$46
N$22
  Top 0.3: JP4.2 37.75,4 36,5.75 28.75,5.75 25.25,9.25 25.25,11.25 23.75,12.75 23.75,21.75 21,21.75 21,23.5 25.75,28.25 26.25,28.25 27.5,29.5 UC1.P$49
N$23
  Top 0.3: U2.7 13.64,42.5 10.25,42.5 10.25,39.98 R33.1
N$25
  Top 0.3: UC1.P$3 38.5,33.75 41.25,31 41.25,29.25 44,26.5 44,25.68 OSC2.1 47.23,24.48 C19.2
N$26
  Top 0.3: Q4.3 68.75,29.8 U$1.K
N$27
  Top 0.3: J1.D- 26.35,5.65 25.5,6.5 20,6.5 R30.2
N$28
  Top 0.3: U2.3 12.37,45.5 9,45.5 R31.1
N$29
  Top 0.3: R24.2 R15.2 25.25,7.75 27,6 J1.D+
N$30
  Top 0.3: U1.P$1 26,67.75 Q9.3
N$31
  Top 0.3: UC1.P$28 29.5,45.5 28.77,46.23 R26.2
N$32
  Top 0.3: R16.2 24.25,48.5 24.5,48.25 24.5,47.98 R26.1
N$33
  Top 0.3: UC1.P$29 29,44 27.5,45.5 27.5,48.75 26.5,48.75 22.75,52.5 16.5,52.5 15.25,53.75 15.25,55.29 JP6.1
N$34
  Top 0.3: UC1.P$30 28.5,43.75 26.75,45.5 26.75,48.25 26.25,48.25 22.5,52 16,52 JP6.2
N$35
  Top 0.3: R6.1 11.75,24.98 11.75,22.25 9.25,22.25 7.75,23.75 Q1.3
N$36
  Top 0.3: UC1.P$4 38.75,34.25 41.75,31.25 41.75,29.5 43.73,27.52 OSC2.4 47.23,27.52 C20.2
N$37
  Top 0.3: C17.2 9.25,47.25 8,47.25 8,43.73 7.98,43.73 | R28.2 16.48,45.73 14.91,44.16 14.91,43.75 14.89,43.73 | R33.2 9,43.48 R31.2
  Top 0.4: U2.8 14.91,43.75 | 8,43.73 R31.2 14.89,43.73 | 7.98,43.73 7.75,43.5 7.75,37.27 R35.1
N$38
  Top 0.3: 12.5,31 15.25,31 15.25,35.25 15,35.25 15,36.23 R36.2 | 12.5,32.02 R7.1 | 12.48,32 R7.1 | R7.1 12.5,31 | R6.2 10.77,28.02 11.25,28.5 11.25,29.75 12.5,31
N$39
  Top 0.3: Q10.1 22.45,18.68 R37.1 | 22.5,18.77 R37.1 | R37.1 22.52,20.72 R38.1
N$40
  Top 0.3: C6.2 77.6,36 U$1.30
N$41
  Top 0.3: R11.1 15.7,68.25 Q6.1 15.7,66.05 16.75,65 16.75,64.15 | 16.75,64.15 Q5.3 20.9,64.15 21,64.25 21,75.75 23,75.75 24,74.75 27.81,74.75 SP1.+ | Q3.3 3.4,61.15 4,61.75 13.75,61.75 14.25,61.75 14.35,61.75 16.75,64.15
N$42
  Top 0.3: 3.5,56 Q7.3 2.15,57.25 2.15,61.25 3.4,62.5 10.25,62.5 | 19.77,66.35 Q5.1 | Q5.1 19.77,66.42 | Q5.1 19.7,68.25 R12.1 19.77,69.48 | 19.77,69.48 18.75,70.5 13.5,70.5 12,69 12,68 11.75,67.75 10.5,67.75 10.25,67.5 10.25,62.5 | SP1.- 19.75,76.52 19.77,76.5 19.77,69.48 | Q6.3 13.1,62.5 10.25,62.5
N$43
  Top 0.3: Q10.3 21.5,13 23.5,11 R15.1
N$44
  Top 0.3: R39.1 JP3.4
N$45  (1 unrouted)
  Top 0.3: D4.A 44.64,47.11 45.25,46.5 45.25,43.25 R41.1
N$46
  Top 0.3: R43.1 15,23.02 15,24.5 14,25.5 C22.2 14,25.52 14,26.25 13.61,26.64 D3.A
N$47
  Top 0.3: C23.2 78.1,34 U$1.29
N$48
  Top 0.3: C24.2 78.6,32 U$1.28
N$49
  Top 0.3: U$1.27 79.1,30 C25.2
N$50  (1 unrouted)
  Top 0.3: U$1.25 80.1,28
N$51
  Top 0.3: U$1.9 88.1,31.13 IC5.28
N$53
  Top 0.3: U$1.10 87.6,32.4 IC5.27
N$54
  Top 0.3: U$1.11 87.1,33.67 IC5.26
N$55
  Top 0.3: U$1.12 86.6,34.94 IC5.25
N$56
  Top 0.3: U$1.13 86.1,36.21 IC5.24
N$57
  Top 0.3: U$1.14 85.6,37.48 IC5.23
N$58
  Top 0.3: U$1.15 85.1,38.75 IC5.22
N$59
  Top 0.3: U$1.16 84.6,40.02 IC5.21
N$60
  Top 0.3: U$1.4 90.6,27.5 94.5,27.5 94.5,31.13 IC5.1
N$61
  Top 0.3: U$1.5 90.1,28 94,28 94,32.4 IC5.2
N$62
  Top 0.3: U$1.6 89.6,28.5 93.5,28.5 93.5,33.67 IC5.3
N$63
  Top 0.3: U$1.7 89.1,29 93,29 93,34.94 IC5.4
N$64
  Top 0.3: U$1.8 88.6,29.5 92.5,29.5 92.5,36.21 IC5.5
N$65  (1 unrouted)
  Top 0.3: U$1.3 U$1.2 91.6,26.75 94,26.75 97.75,26.75
N$66
  Top 0.2: U$2.10 34.65,11.17 C29.1
OSC_IN_5
  Top 0.3: UC1.P$5 41.09,34.75 OSC.2 43.25,30.27 C12.2
OSC_OUT_6
  Top 0.3: 38.75,35.25 UC1.P$6 42,35.25 42.25,35 C13.2 43.23,37.4 OSC.1
SENS_PWR  (via drill 0.35)  (5 unrouted)
  Top 0.2: 38.65,13.35 U$2.13 | 38.65,13.35 38.65,17.55 34.25,17.55 | 34.25,17.55 U$2.22 | U$2.1 31.65,15.35 v31.65,18.35 | 34.25,17.55 v34.65,18.35 | U$2.8 33.85,11.15 32.85,10.35 | 32.85,10.35 31.65,10.35 31.65,7.15 38.65,7.15 38.65,10.35 | 38.65,10.35 38.65,13.35 | C18.1 32.85,10.35 | C30.1 38.65,10.35
  Top 0.3: IC4.P$5 45.9,17 | 45.9,17 IC4.P$4 | 43.4,17 IC4.P$2 IC4.P$1 | 43.4,17 45.9,17 | 43.4,17 41,17 41,19.98
  Bottom 0.2: v34.65,18.35 v31.65,18.35
SENS_SCL  (1 unrouted)
  Top 0.2: U$2.23 33.85,18.95
  Top 0.3: UC1.P$58 32,28.02 | 32,28.02 R45.1 | 32,28.02 32,27.25 31.75,27 31.75,24.27 R18.1 30.75,24.25 30.75,20.25 31,20.25 | 33.85,18.95 33.85,23.85 34,24
SENS_SDA
  Top 0.2: 33.45,18.95 U$2.24
  Top 0.3: UC1.P$59 32.5,29.5 33,29 33,26.48 R44.1 32.77,22.99 R17.1 31.77,20.27 31.75,20.25 32.15,20.25 33.45,18.95
SND_1P  (via drill 0.7 pad 1.7)
  Top 0.3: R27.1 6.23,50.73 4.75,49.25 v4.75,38 | v20,38 21,38 22.75,36.25 UC1.P$41
  Bottom 0.3: v20,38 v4.75,38
SND_2P  (via drill 0.7 pad 1.7)
  Top 0.3: UC1.P$42 21,35.75 v20.75,36 | R29.2 4,50 3.25,49.25 3.25,36.5 v3.75,36
  Bottom 0.3: v20.75,36 v3.75,36
SND_PWR
  Top 0.4: IC1.1 1.9,26.7 | 1.9,26.7 1,26.7 1,61.7 2.8,63.5 8.5,63.5 8.73,63.73 R2.2 | IC3.3 1.75,24.25 | IC3.3 1.9,21.5 C15.1 C11.1 2.23,19.35 3.93,17.66 5.34,17.66 6.25,16.75 D1.C 7,14.8 Q8.2 | IC3.3 1.9,26.7
USB_CON
  Top 0.3: UC1.P$51 28.5,29.5 26.75,27.75 26,27.75 22.5,24.25 R38.2
USB_VBUS
  Top 0.3: R8.2 19,12.27 19,13.25 17.75,14.5 17.75,15.5 16.88,16.38 16.88,18.38 16.25,19 16.25,21.25 | UC1.P$43 23.75,35.25 18,29.5 18,25.5 C22.1 16.25,25.23 16.25,21.25 | R9.1 16.25,21.25
USBDM  (1 unrouted)
  Top 0.3: 20.25,9.75 20.25,13 18.25,15 18.25,25 19,25.75 19,29.75 24,34.75 UC1.P$44
USBDP
  Top 0.3: R24.1 21.75,10.75 20.75,11.75 20.75,13.25 18.75,15.25 18.75,24.75 19.5,25.5 19.5,29.5 24.25,34.25 UC1.P$45
VCC  (via drill 0.7 pad 1.7)  (1 unrouted)
  Top 0.3: UC1.P$64 36,30.56 | UC1.P$19 34,47.52 C21.2 35.48,47.52 36.25,46.75 38.23,46.75 | UC1.P$13 35.5,38.75 35.5,42.25 v36.5,43.25 | 36.02,29.27 36,29.25 | UC1.P$32 26.59,42.41 26,43 v26,43.25 | UC1.P$1 37.19,30.56 37.25,30.56 | 27.02,65.4 Q9.2 | C14.2 37.5,30.56 | Q10.2 20.55,18.43 R37.2 20.5,18.77 20.5,26.5 v23,29 | UC1.P$48 24.5,32.75 24,32.25 24,30 v23,29 | v23,29 25.02,29 C9.2 | 38.23,46.75 R39.2 | 38.23,46.75 38.23,44.77 v39,44
  Top 0.4: v36,29 36,29.25 36,30.56 37.25,30.56 37.5,30.56 37.94,30.56 v39,29.5 | 27.02,65.4 R10.2 | U1.P$4 R10.2 | 10,50.75 7.75,50.75 7.75,49.5 6.25,48 6.25,32.27 4.5,32.27 | 10,50.75 18.25,50.75 19.75,49.25 19.75,48 21.73,46.02 C10.2 23.02,45.75 23.5,45.75 v26,43.25 | 4.5,32.27 8,32.27 | 4.5,32.27 2.55,32.27 IC1.5 | 10,32.27 8.5,32.27 C4.1 8.5,32.27 8,32.27 | 4.75,32.27 8,32.27 | v39,44 38.25,43.25 v36.5,43.25 | R10.2 27.02,62.02 27,62 19.25,62 | 19.25,62 18.75,62 16.75,60 10,60 10,50.75 | 19.25,62 19.25,59.67 JP2.2 | R35.2 9.25,33.5 10,32.75 C3.1
  Bottom 0.3: v39,29.5 v39,44 | v36,29 v23,29 | v26,43.25 v36.5,43.25
VCC_T  (3 unrouted)
  Top 0.3: 82.5,5.5 BTN_C.1 | U$1.26 79.6,23.5 82.6,23.5 | 82.6,23.5 U$1.20 U$1.17 | C28.2 C27.2 83.02,37.98 83.75,37.25 83.75,26.5 83.6,26.35 U$1.18 | 82.6,23.5 92.1,23.5 U$1.1 103.75,25.25 | U$1.A 66.65,27 72.75,27 72.75,19.25 98.5,19.25 | 103.75,25.25 103.75,19.25 98.5,19.25 | JP1.3 93.89,66.25 103.75,66.25 103.75,41.29 | 103.75,41.29 103.75,25.25 | IC5.9 103.75,41.29 | 98.5,5.5 BTN_L.4 | 82.5,5.5 98.5,5.5 | 98.5,19.25 BTN_L.1 98.5,5.5 | 71,5.5 BTN_R.1 | 71,5.5 82.5,5.5 | BTN_R.4 71,5.5
WAKE_UP  (via drill 0.7 pad 1.7)
  Top 0.3: v38,41.75 36.25,41.75 36,41.5 36,39.25 UC1.P$14 39,39.25 41.98,42.23 R34.2 42,45.27 42,46.25 41.36,46.89 D4.C | v19,33.5 18,32.25 18,30.75 16.89,29.64 D3.C
  Bottom 0.3: v38,41.75 v19,33.5
(copper drawn outside any net)
  shapes: Bottom area x1, Top area x2, Top circle x17

### Text on the board
tNames: din | dclk | wup | dclk | din